# EasyEDA schematic seedrum_ec_v1.json
TITLE: Seedup EC; REV: 1.0; Date: 2020-10-29; Sheet: 1/1; Drawn By: victor.halla; Company: Seedup
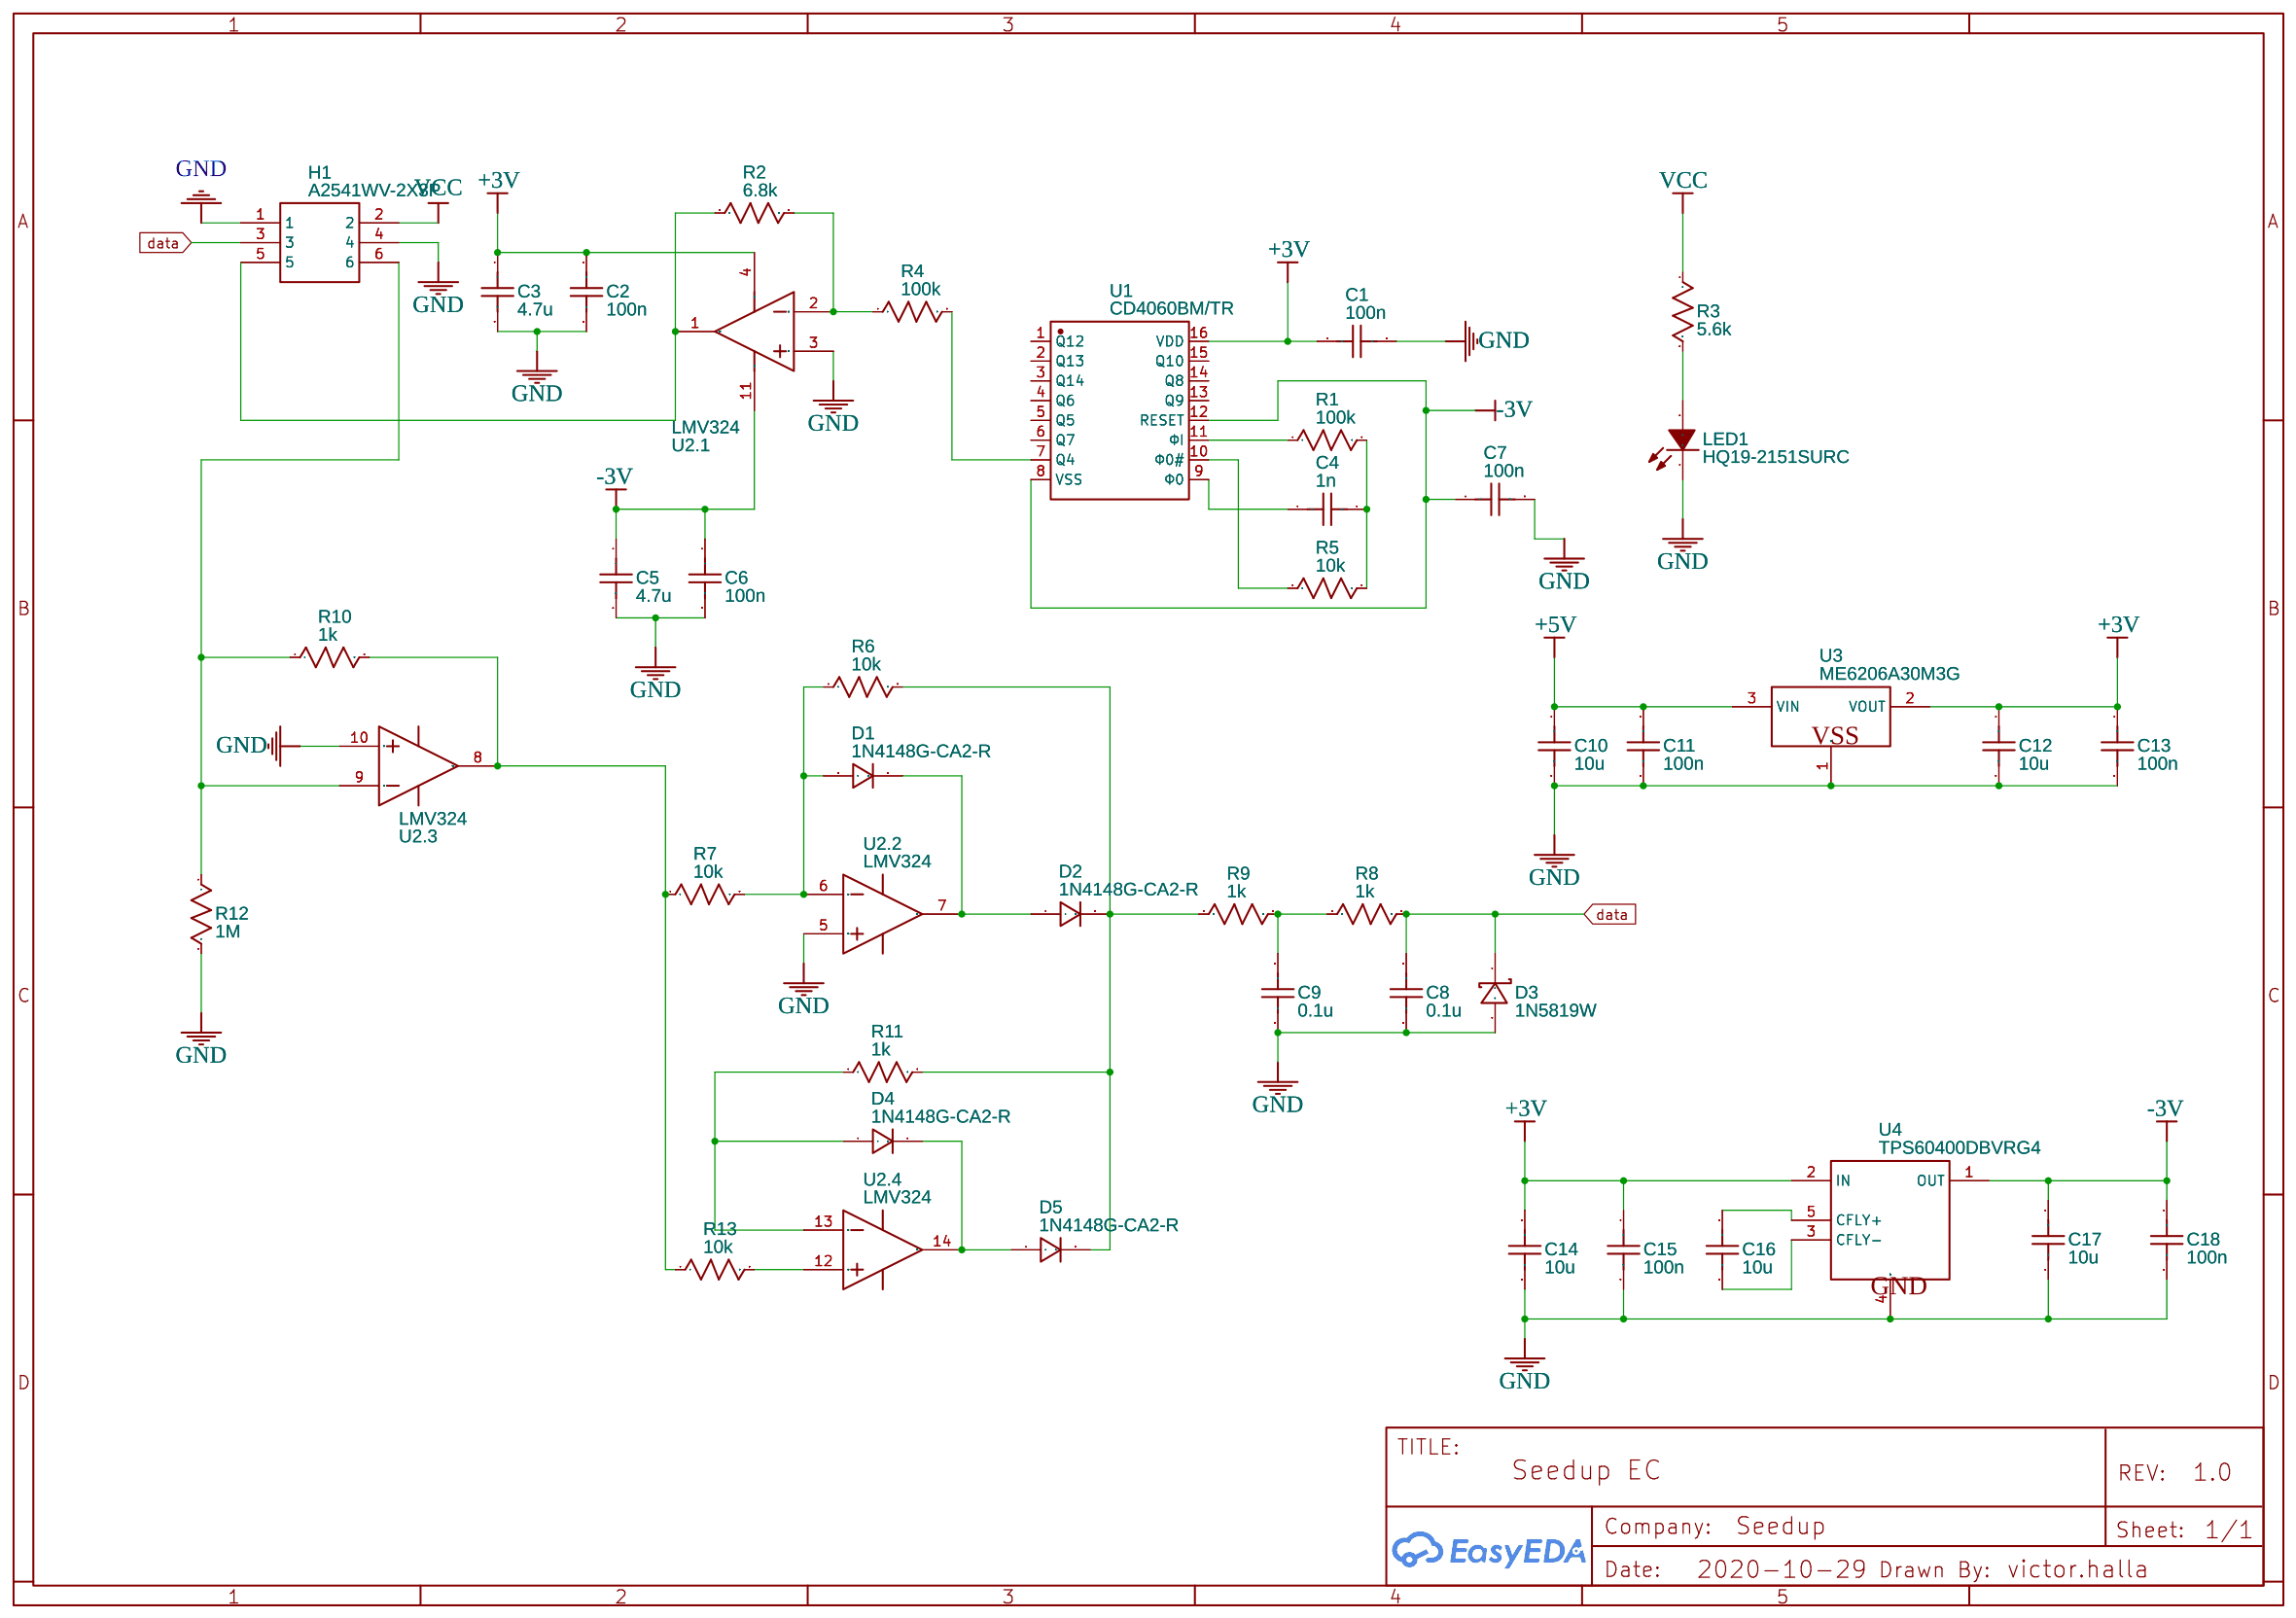
[diagram p0: schematic sheet]

## Parts
C1  100n  [C0603]
C2  100n  [C0603]
C3  4.7u  [C0603]
C4  1n  [C0603]
C5  4.7u  [C0603]
C6  100n  [C0603]
C7  100n  [C0603]
C8  0.1u  [C0603]
C9  0.1u  [C0603]
C10  10u  [C0603]
C11  100n  [C0603]
C12  10u  [C0603]
C13  100n  [C0603]
C14  10u  [C0603]
C15  100n  [C0603]
C16  10u  [C0603]
C17  10u  [C0603]
C18  100n  [C0603]
D1  1N4148G-CA2-R  [SOD-123_L2.8-W1.8-LS3.7-FD]
D2  1N4148G-CA2-R  [SOD-123_L2.8-W1.8-LS3.7-FD]
D3  1N5819W  [SOD-123F_L2.8-W1.8-LS3.7-RD]
D4  1N4148G-CA2-R  [SOD-123_L2.8-W1.8-LS3.7-FD]
D5  1N4148G-CA2-R  [SOD-123_L2.8-W1.8-LS3.7-FD]
H1  A2541WV-2X3P  [HDR-TH_6P-P2.54-V-R2-C3-S2.54_A2541WV-2X3P]
LED1  HQ19-2151SURC  [LED0603-RD]
R1  100k  [R0603]
R2  6.8k  [R0603]
R3  5.6k  [R0603]
R4  100k  [R0603]
R5  10k  [R0603]
R6  10k  [R0603]
R7  10k  [R0603]
R8  1k  [R0603]
R9  1k  [R0603]
R10  1k  [R0603]
R11  1k  [R0603]
R12  1M  [R0603]
R13  10k  [R0603]
U1  CD4060BM/TR  [SOP-16_L9.9-W3.9-P1.27-LS6.1-BL]
U2  LMV324  [SOP-14_L8.6-W3.9-P1.27-LS6.0-BL]  (sections 1,2,3,4)
U3  ME6206A30M3G  [SOT-23-3_L2.9-W1.3-P1.90-LS2.4-BR]
U4  TPS60400DBVRG4  [SOT23-5]

## Library data of the parts
C1-C18 = C_0603_US: Contributor: LCEDA_Lib
D1 D2 D4 D5 = 1N4148G-CA2-R: Supplier Part: C171560; Supplier: LCSC; Manufacturer: UTC; Contributor: LCSC
D3 = 1N5819W: Supplier: LCSC; Supplier Part: C169540; Manufacturer: Shandong Jingdao Microelectronics; Contributor: LCSC; LCSC Assembly: Yes; SMT Type: Extend
H1 = A2541WV-2X3P: Supplier: LCSC; Supplier Part: C225518; Manufacturer: Changjiang Connectors; Manufacturer Part: A2541WV-2x3P; Contributor: LCSC
LED1 = HQ19-2151SURC: Supplier: LCSC; Supplier Part: C258842; Manufacturer: Harvatek Optoelectronics (Shenzhen); Contributor: LCSC
R1-R13 = R_0603_US: Contributor: LCEDA_Lib
U1 = CD4060BM/TR: Supplier: LCSC; Supplier Part: C512772; Manufacturer: HGSEMI; Contributor: LCSC
U2 = LMV324: Supplier: LCSC; Supplier Part: C395458; Manufacturer: IDCHIP; subpart_no: 1
U3 = ME6206A30M3G: Supplier: LCSC; Supplier Part: C487911; Manufacturer: MICRONE(Nanjing Micro One Elec); Contributor: LCSC
U4 = TPS60400DBVRG4: -1.8 to -5.25 V, Inverting Charge Pump, 60 mA, 1.8 to 5.25 V Input with 2-Cell Alkaline  Nixx Input, -40 to 85 degC, 5-pin SOT23 (DBV5), Green (RoHS  no SbBr)

## Nets
+3V: C1.1 C2.1 C3.1 C12.1 C13.1 C14.1 C15.1 U1.16(VDD) U2.4(VCC) U3.2(VOUT) U4.2(IN)
+5V: C10.1 C11.1 U3.3(VIN)
-3V: C5.1 C6.1 C7.1 C17.1 C18.1 U1.8(VSS) U1.12(RESET) U2.11(GND) U4.1(OUT)
GND: C1.2 C2.2 C3.2 C5.2 C6.2 C7.2 C8.2 C9.2 C10.2 C11.2 C12.2 C13.2 C14.2 C15.2 C17.2 C18.2 D3.2 H1.1 H1.4 LED1.1(K) R12.2 U2.3(1IN+) U2.5(2IN+) U2.10(3IN+) U3.1(VSS) U4.4(GND)
VCC: H1.2 R3.1
data: C8.1 D3.1 H1.3 R8.2
Net-(C4-1): C4.1 U1.9(Φ0)
Net-(C4-2): C4.2 R1.2 R5.2
Net-(C9-1): C9.1 R8.1 R9.2
Net-(C16-1): C16.1 U4.5(CFLY+)
Net-(C16-2): C16.2 U4.3(CFLY-)
Net-(D1-1): D1.1(A) R6.1 R7.2 U2.6(2IN-)
Net-(D1-2): D1.2(C) D2.1(A) U2.7(2OUT)
Net-(D2-2): D2.2(C) D5.2(C) R6.2 R9.1 R11.2
Net-(D4-1): D4.1(A) R11.1 U2.13(4IN-)
Net-(D4-2): D4.2(C) D5.1(A) U2.14(4OUT)
Net-(H1-5): H1.5 R2.1 U2.1(1OUT)
Net-(H1-6): H1.6 R10.1 R12.1 U2.9(3IN-)
Net-(LED1-2): LED1.2(A) R3.2
Net-(R1-1): R1.1 U1.11(ΦI)
Net-(R2-2): R2.2 R4.1 U2.2(1IN-)
Net-(R4-2): R4.2 U1.7(Q4)
Net-(R5-1): R5.1 U1.10(Φ0#)
Net-(R7-1): R7.1 R10.2 R13.1 U2.8(3OUT)
Net-(R13-2): R13.2 U2.12(4IN+)

Not connected (* = marked no-connect by the designer): U1 1(Q12) 2(Q13) 3(Q14) 4(Q6) 5(Q5) 6(Q7) 13(Q9) 14(Q8) 15(Q10)
